# EasyEDA Pro project oscillation.eprj

# Schematic LM358V1
Create Date: 2023-12-05; Page Name: LM358V1; Project Name: oscillation; Schematic Name: LM358V1; Update Date: 2023-12-06; Company: 嘉立创EDA; Page Size: A4; Version: V1.0
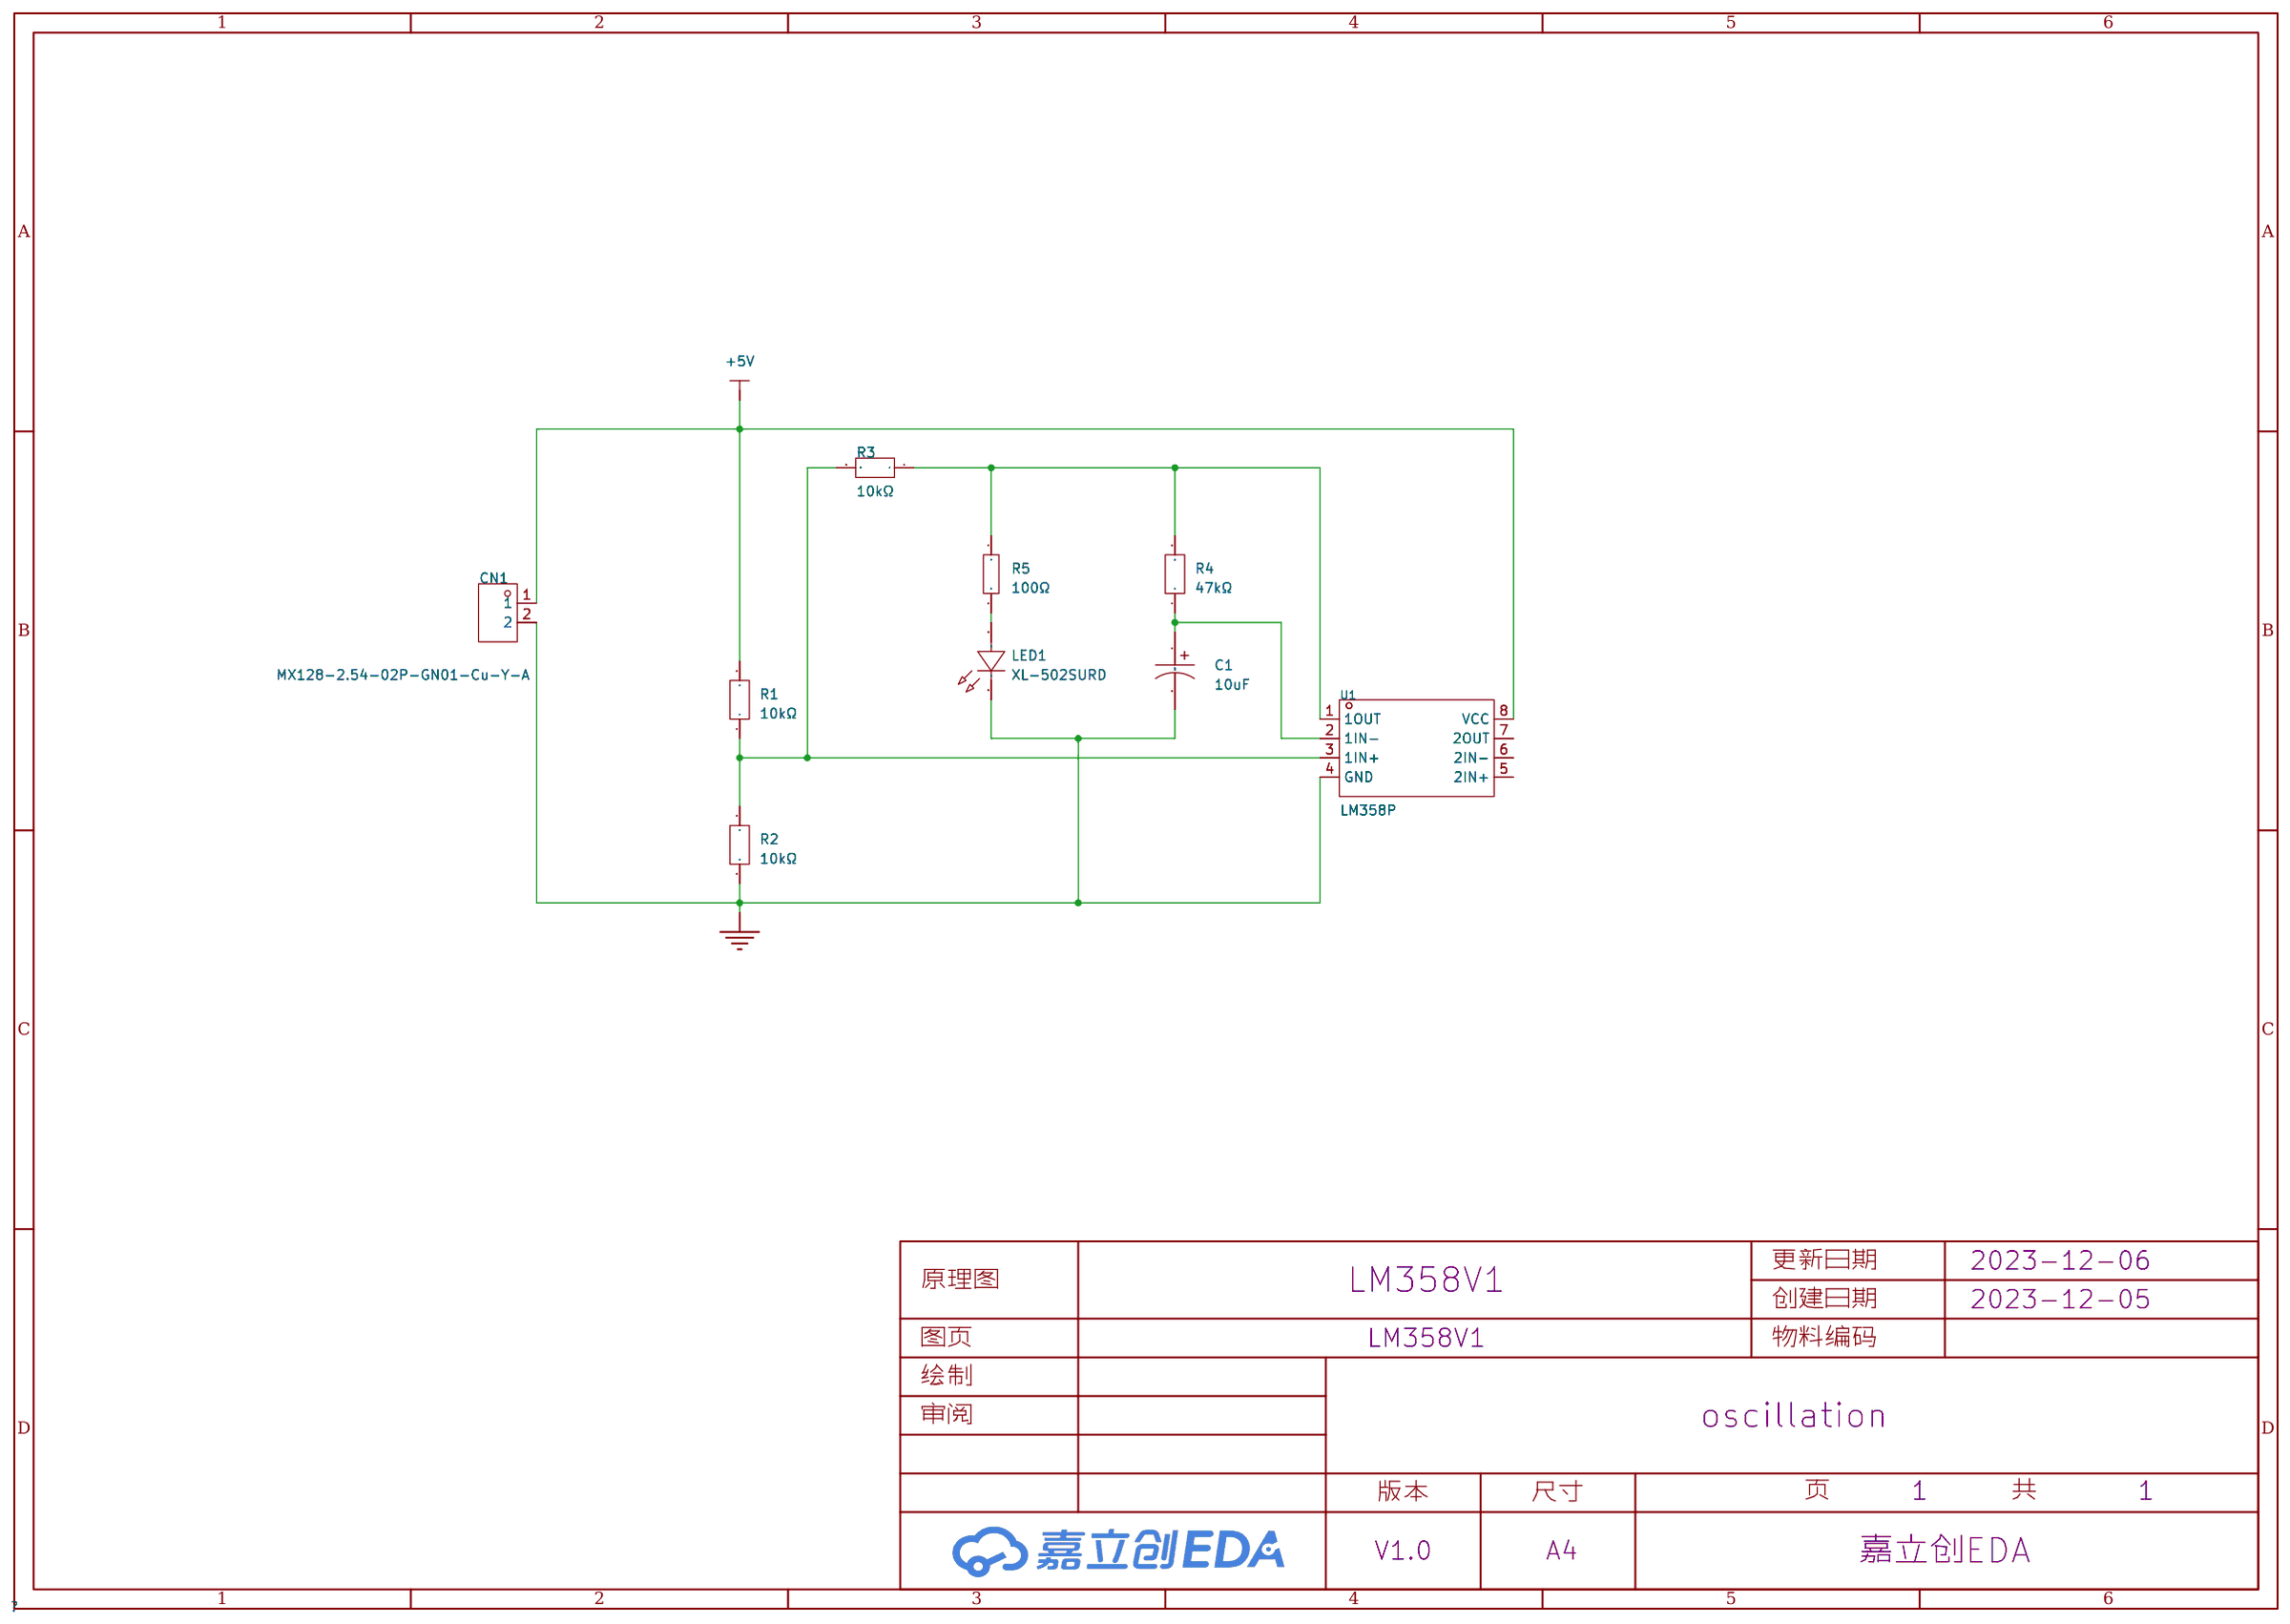
[diagram p0: schematic sheet]

## Parts
C1  10uF  [CAP-TH_BD5.0-P2.00-D0.8-FD]
CN1  MX128-2.54-02P-GN01-Cu-Y-A  [CONN-TH_2P-P2.54_MX128-2.54-GN01-02P-CU-Y-A]
LED1  XL-502SURD  [LED-TH_BD5.9-P2.54-RD_RED]
R1  10kΩ  [RES-TH_BD2.4-L6.3-P10.30-D0.6]
R2  10kΩ  [RES-TH_BD2.4-L6.3-P10.30-D0.6]
R3  10kΩ  [RES-TH_BD2.4-L6.3-P10.30-D0.6]
R4  47kΩ  [RES-TH_BD2.7-L6.2-P10.20-D0.4]
R5  100Ω  [RES-TH_BD2.2-L6.5-P10.50-D0.6]
U1  LM358P  [DIP-8_L9.4-W6.4-P2.54-LS9.1-BL]

## Library data of the parts
C1 = 01EC1809SHC10UF50V: 容值:10uF;精度:±20%;额定电压:50V;纹波电流:50mA@120Hz;等效串联电阻:-;; LCSC Part Name: 10uF ±20% 50V; Supplier Part: C503219; Manufacturer: KNSCHA(科尼盛); Supplier Footprint: 插件,D5xL11mm; JLCPCB Part Class: 扩展库; Datasheet: https://atta.szlcsc.com/upload/public/pdf/source/20200324/C503219_39D1683F20D4DB1C41D8BE9142629697.pdf; Supplier: LCSC; Tolerance: ±20%; Rated Voltage: 50V; Ripple Current: 50mA@120Hz; Lead Spacing: 2mm; φD: 5mm; L: 11mm; Lifetime @ Temp: 5000hrs@105℃
CN1 = MX128-2.54-02P-GN01-Cu-Y-A: 间距:2.54mm;结构:1x2P;安装方式:直插;排数:1;额定电流:6A;额定电压:150V;线规 - AWG:18~24;线规 - mm2:1;触头材质:铜合金;触头镀层:锡;工作温度范围:-40℃~+105℃;颜色:绿色;每排PIN数:2;; LCSC Part Name: 2.54mm 1x2P 排数:1 每排P数:2 直插; Supplier Part: C5188442; Manufacturer: MAX(迈旭); Supplier Footprint: 插件,P=2.54mm; JLCPCB Part Class: 扩展库; Datasheet: https://atta.szlcsc.com/upload/public/pdf/source/20230914/7C75AD31AD41EB9EF855A76DB002C0D2.pdf; Supplier: LCSC; Pitch: 2.54mm; Structure: 1x2P; Mounting Style: 直插; Number of Pins: 2P; Number of Rows: 1; Current Rating (Max): 6A; Voltage Rating (Max): 150V; Wire Gauge - AWG: 18~24; Wire Gauge - mm2: 1; Contact Material: 铜合金; Contact Plating: 锡; Operating Temperature Range: -40℃~+105℃; Color: 绿色; Number of PINs Per Row: 2
LED1 = XL-502SURD: 发光颜色:红灯;主波长:-;色温:-;功率:80mW;安装方式:-;; LCSC Part Name: 红灯; Supplier Part: C2895492; Manufacturer: XINGLIGHT(成兴光); Supplier Footprint: 插件,D=5mm; JLCPCB Part Class: 扩展库; Datasheet: https://atta.szlcsc.com/upload/public/pdf/source/20220816/7D3B6C5DAA6D3D612C28AF3454ED9DF8.pdf; Supplier: LCSC; Emitted Color: 红灯; Lens Color: 红色; Peak Wavelength: 625nm; Forward Current: 20mA; Power Dissipation: 80mW; Viewing Angle: 50°; Operating Temperature: -25℃~+85℃; Lamp Holder Type: 5mm圆形灯头
R1-R3 = RN1/4W10KFT/BA1: 阻值:10kΩ;精度:±1%;功率:250mW;温度系数:±50ppm/℃;电阻类型:金属膜电阻;; LCSC Part Name: 10kΩ ±1% 250mW 金属膜电阻; Supplier Part: C410695; Manufacturer: Tyohm(幸亚电阻); Supplier Footprint: 插件; JLCPCB Part Class: 扩展库; Datasheet: https://atta.szlcsc.com/upload/public/pdf/source/20190808/C410699_D126E64D28B638F1D73B58E9F61DFD9B.pdf; Supplier: LCSC; Tolerance: ±1%; Power(Watts): 250mW; Overload Voltage (Max): 250V; Temperature Coefficient: ±50ppm/℃; Type: 金属膜电阻; Operating Temperature Range: -55℃~+125℃
R4 = MF1/4W-47K±1%-ST52: 阻值:47kΩ;精度:±1%;功率:250mW;温度系数:±350ppm/℃;电阻类型:金属膜电阻;; LCSC Part Name: 金属膜电阻 47kΩ ±1% 250mW; Supplier Part: C2857423; Manufacturer: VO(翔胜); Supplier Footprint: 插件,2.7x6.2mm; JLCPCB Part Class: 扩展库; Supplier: LCSC; Tolerance: ±1%; Power(Watts): 250mW; Overload Voltage (Max): 250V; Temperature Coefficient: ±350ppm/℃; Type: 金属膜电阻; Operating Temperature Range: -55℃~+155℃
R5 = MFR0W4F1000A50: 阻值:100Ω;精度:±1%;功率:250mW;温度系数:±50ppm/℃;电阻类型:金属膜电阻;; LCSC Part Name: 100Ω ±1% 250mW 金属膜电阻; Supplier Part: C57438; Manufacturer: UNI-ROYAL(厚声); Supplier Footprint: 插件; JLCPCB Part Class: Extended Part; Datasheet: https://atta.szlcsc.com/upload/public/pdf/source/20191012/C436293_8820AA14BC71FA35E551C06C441482A0.pdf; Supplier: LCSC; Tolerance: ±1%; Power(Watts): 250mW; Overload Voltage (Max): 250V; Temperature Coefficient: ±50ppm/℃; Type: 金属膜电阻
U1 = LM358P: 放大器组数:2;带宽(-3db):-;输入偏置电流(Ib):20nA;增益带宽积(GBP):700kHz;压摆率(SR):0.3V/us;; Supplier Part: C5213; Manufacturer: TI(德州仪器); Supplier Footprint: DIP-8; JLCPCB Part Class: 扩展库; Datasheet: http://www.ti.com/cn/lit/gpn/lm358; Supplier: LCSC; Number of Circuits: 2; Current - Input Bias(Ib): 20nA; Gain Bandwidth Product(GBP): 700kHz; Slew Rate(SR): 0.3V/us; Output Current: 40mA; Supply Current: 1mA; Operating Temperature: 0℃~+70℃

## Nets
+5V: CN1.1 R1.2 U1.8(VCC)
GND: C1.2 CN1.2 LED1.1(K) R2.1 U1.4(GND)
$1N607: R1.1 R2.2 R3.2 U1.3(1IN+)
$1N832: LED1.2(A) R5.2
$1N1121: R3.1 R4.2 R5.1 U1.1(1OUT)
$1N1178: C1.1 R4.1 U1.2(1IN-)

Not connected (* = marked no-connect by the designer): U1 5(2IN+) 6(2IN-) 7(2OUT)

# Schematic IRM_ITR2001V1
Create Date: 2024-06-09; Page Name: P1; Project Name: oscillation; Schematic Name: ITR2001V1; Update Date: 2024-06-09; Company: 嘉立创EDA; Page Size: A4; Version: V1.0
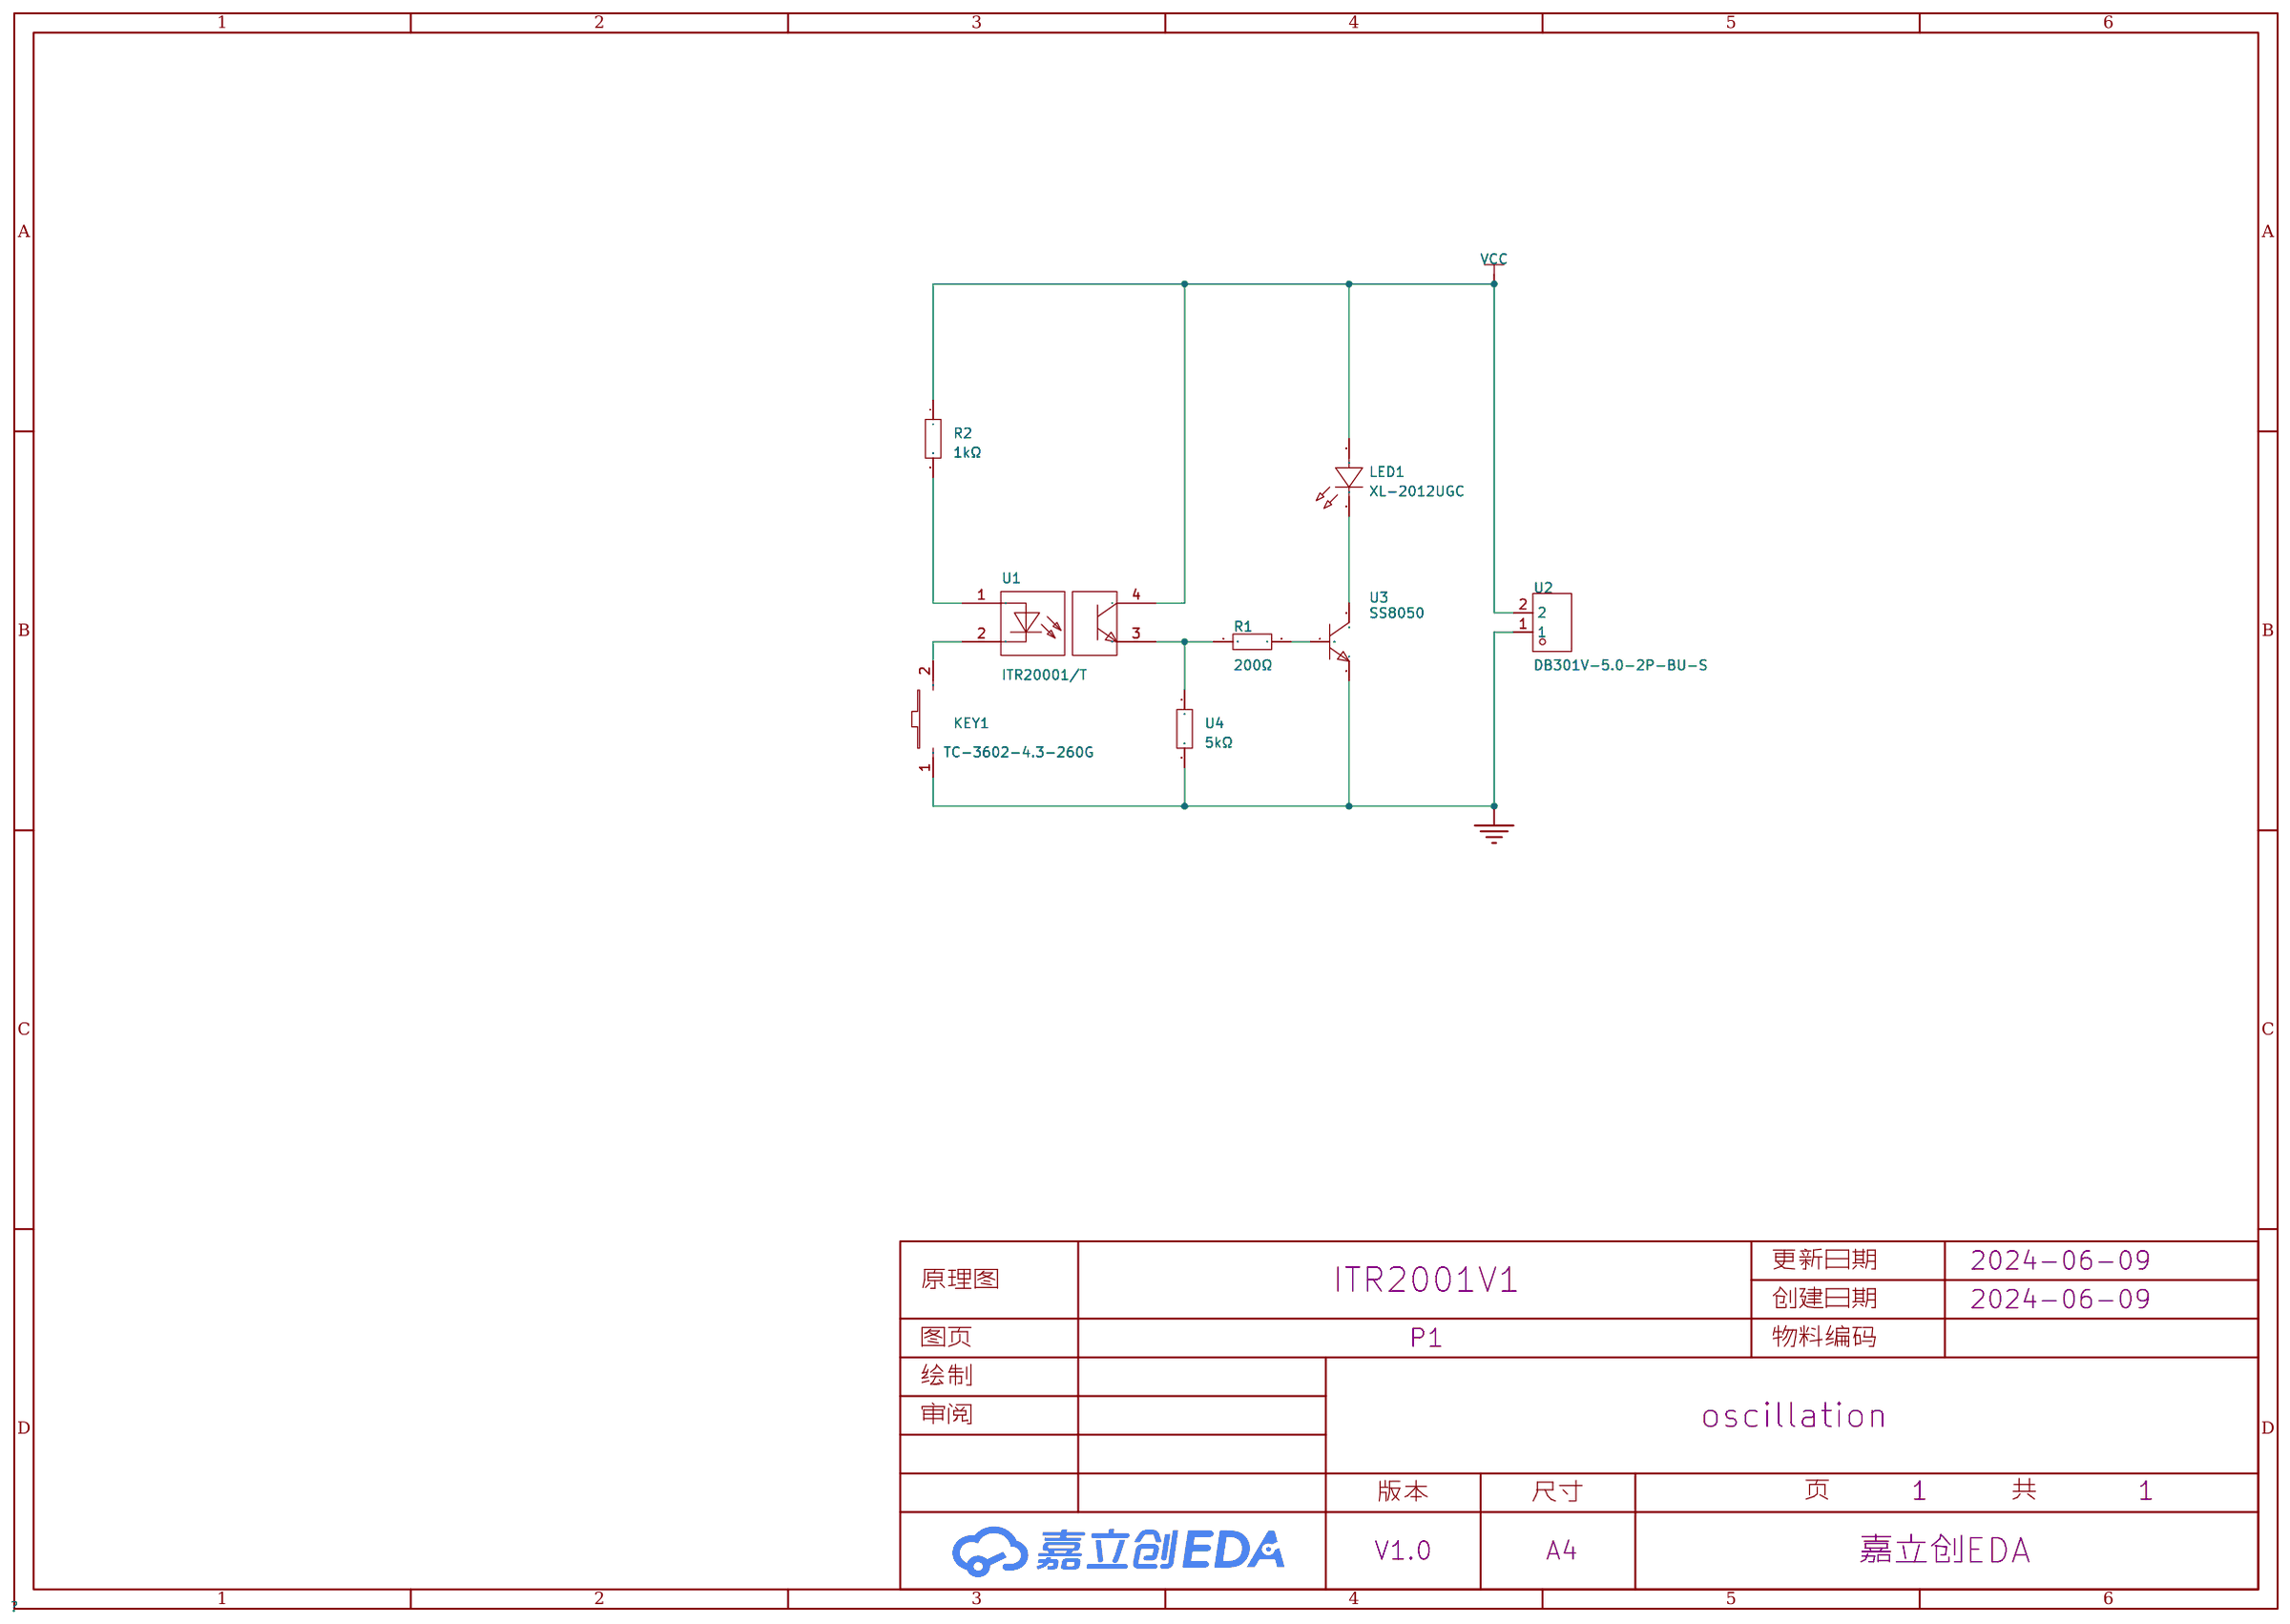
[diagram p1: schematic sheet]

## Parts
KEY1  TC-3602-4.3-260G  [KEY-SMD_L6.0-W3.6-LS8.3-L]
LED1  XL-2012UGC  [LED0805-RD_GREEN]
R1  200Ω  [R0603]
R2  1kΩ  [R0603]
U1  ITR20001/T  [OPTO-TH_4P_ITR20001-T-F316]
U2  DB301V-5.0-2P-BU-S  [CONN-TH_2P-P5.00_L7.6-W10.0]
U3  SS8050  [SOT-23-3_L2.9-W1.3-P1.90-LS2.4-BR]
U4  5kΩ  [R0603]

## Library data of the parts
KEY1 = TC-3602-4.3-260G_C3012022: 电路结构:单刀单掷;带支架:否;触点电流:50mA;额定电压(AC):-;额定电压(DC):12V;额定功率:-;安装方式:立贴;绝缘电阻:-;带灯:无;作用力:260gf;机械寿命:10万次;; LCSC Part Name: 3*6*4.3mm 立贴 轻触开关; Supplier Part: C3012022; Manufacturer: HCTL(华灿天禄); Supplier Footprint: SMD; JLCPCB Part Class: 扩展库; Datasheet: https://atta.szlcsc.com/upload/public/pdf/source/20210730/C2845293_5277CDF8C59032B794BE536E6FDEACDD.pdf; Supplier: LCSC; Circuit: 单刀单掷; Actuator Style: 圆形按钮; Switch Length: 3mm; Switch Width: 6mm; Switch Height: 4.3mm; Strike Gundam: 否; Contact Current: 50mA; Voltage Rating (DC): 12V; Mounting Style: 立贴; Actuator/Cap Color: 白色; With Lamp: 无; Operating Force: 260gf; Mechanical Life: 10万次; Operating Temperature: -30℃~+85℃
LED1 = XL-2012UGC: 发光颜色:翠绿色;功率:80mW;正向电流:25mA;主波长:516nm~525nm;透镜颜色:无色透明透镜;色温:-;发光角度:120°;载带方式:正贴;工作温度:-30℃~+85℃;; Supplier Part: C965815; Manufacturer: XINGLIGHT(成兴光); Supplier Footprint: 0805; JLCPCB Part Class: 扩展库; Datasheet: https://atta.szlcsc.com/upload/public/pdf/source/20221102/ACA6CBC413A1A8AF38BEBA54306464BE.pdf; Supplier: LCSC; Emitted Color: 翠绿色; Power Dissipation: 80mW; Forward Current: 25mA; Dominant Wavelength: 516nm~525nm; Peak Wavelength: 534nm; Lens Color: 无色透明透镜; Viewing Angle: 120°; Mounting Sytle: 正贴; Operating Temperature: -30℃~+85℃
R1 = 0603WAF2000T5E: 电阻类型:厚膜电阻;阻值:200Ω;精度:±1%;功率:100mW;最大工作电压:75V;温度系数:±100ppm/℃;; LCSC Part Name: 200Ω ±1% 100mW 厚膜电阻; Supplier Part: C8218; Manufacturer: UNI-ROYAL(厚声); Supplier Footprint: 0603; JLCPCB Part Class: 基础库; Datasheet: https://atta.szlcsc.com/upload/public/pdf/source/20200306/C422600_1E6D84923E4A46A82E41ADD87F860B5C.pdf; Supplier: LCSC; Type: 厚膜电阻; Tolerance: ±1%; Power(Watts): 100mW; Overload Voltage (Max): 75V; Temperature Coefficient: ±100ppm/℃; Operating Temperature Range: -55℃~+155℃
R2 = RC0603FR-071KL: 电阻类型:厚膜电阻;阻值:1kΩ;精度:±1%;功率:100mW;最大工作电压:75V;温度系数:±100ppm/℃;; LCSC Part Name: 厚膜电阻 1kΩ ±1% 100mW; Supplier Part: C22548; Manufacturer: YAGEO(国巨); Supplier Footprint: 0603; JLCPCB Part Class: 扩展库; Datasheet: https://atta.szlcsc.com/upload/public/pdf/source/20180316/70C0E2BDAE7FCC62C531A5A58D202EE1.pdf; Supplier: LCSC; Type: 厚膜电阻; Tolerance: ±1%; Power(Watts): 100mW; Overload Voltage (Max): 75V; Temperature Coefficient: ±100ppm/℃; Operating Temperature Range: -55℃~+155℃
U1 = ITR20001/T: 感应距离:5mm;集电极电流(最大值):20mA;; Supplier Part: C264269; Manufacturer: EVERLIGHT(亿光); Supplier Footprint: DIP-4; JLCPCB Part Class: 扩展库; Datasheet: https://atta.szlcsc.com/upload/public/pdf/source/20180817/C264269_4256B5400489B2A8B2B17FEF85C63C6F.pdf; Supplier: LCSC; Sensing Distance: 5mm; Collector Current (Max): 20mA
U2 = DB301V-5.0-2P-BU-S: 结构:1x2P;间距:5mm;颜色:蓝色;安装方式:直插;额定电流:17.5A;额定电压:250V;排数:1;线规 - AWG:14~22;线规 - 平方毫米:1.5;每排PIN数:2;工作温度范围:-40℃~+120℃;; LCSC Part Name: 5mm 1x2P 排数:1 每排P数:2 直插; Supplier Part: C395882; Manufacturer: DORABO(地博电气); Supplier Footprint: 插件,P=5mm; JLCPCB Part Class: 扩展库; Datasheet: https://atta.szlcsc.com/upload/public/pdf/source/20230321/D511151DA9A574FE7610C3CBEF6C1AC3.pdf; Supplier: LCSC; Structure: 1x2P; Pitch: 5mm; Color: 蓝色; Mounting Style: 直插; Current Rating (Max): 17.5A; Voltage Rating (Max): 250V; Number of Pins: 2P; Number of Rows: 1; Wire Gauge - AWG: 14~22; Wire Gauge - mm2: 1.5; Number of PINs Per Row: 2; Operating Temperature Range: -40℃~+120℃
U3 = SS8050_C7420370: 晶体管类型:NPN;集电极电流(Ic):1.5A;集射极击穿电压(Vceo):25V;功率(Pd):300mW;直流电流增益(hFE@Ic,Vce):120@100mA,1.0V;; LCSC Part Name: 耐压:25V 电流:1.5A NPN H档 200-350; Supplier Part: C7420370; Manufacturer: 宏迦橙; Supplier Footprint: SOT-23; JLCPCB Part Class: 扩展库; Datasheet: https://atta.szlcsc.com/upload/public/pdf/source/20231222/9C4050A7669EB24B3ACD0418218817FD.pdf; Supplier: LCSC; Transistor Type: NPN; Collector Current (Ic): 1.5A; Collector-Emitter Breakdown Voltage (Vceo): 25V; Power Dissipation (Pd): 300mW; DC Current Gain (hFE@Ic,Vce): 120@100mA,1.0V; Transition Frequency (fT): 100MHz; Collector Cut-Off Current (Icbo): 100nA; Collector-Emitter Saturation Voltage (VCE(sat)@Ic,Ib): 500mV@800mA,80mA; Operating Temperature: -55℃~+150℃
U4 = RT0603BRE075KL: 电阻类型:薄膜电阻;阻值:5kΩ;精度:±0.1%;功率:100mW;温度系数:±50ppm/℃;; LCSC Part Name: 薄膜电阻 5kΩ ±0.1% 100mW; Supplier Part: C862232; Manufacturer: YAGEO(国巨); Supplier Footprint: 0603; JLCPCB Part Class: 扩展库; Datasheet: https://atta.szlcsc.com/upload/public/pdf/source/20200610/C326738_5639A9F1B6EB6E4AE2197577D3456E7F.pdf; Supplier: LCSC; Type: 薄膜电阻; Tolerance: ±0.1%; Power(Watts): 100mW; Temperature Coefficient: ±50ppm/℃; Operating Temperature Range: -55℃~+155℃

## Nets
GND: KEY1.1 U2.1 U3.2(E) U4.2
VCC: LED1.2(A) R2.1 U1.4 U2.2
$1N421: KEY1.2 U1.2
$1N496: LED1.1(K) U3.3(C)
$1N669: R1.1 U1.3 U4.1
$1N670: R1.2 U3.1(B)
$1N788: R2.2 U1.1

# Schematic IRM_940NMV1
Create Date: 2024-06-10; Page Name: P1; Project Name: oscillation; Schematic Name: IRM_940NMV1; Update Date: 2024-06-10; Company: 嘉立创EDA; Page Size: A4; Version: V1.0
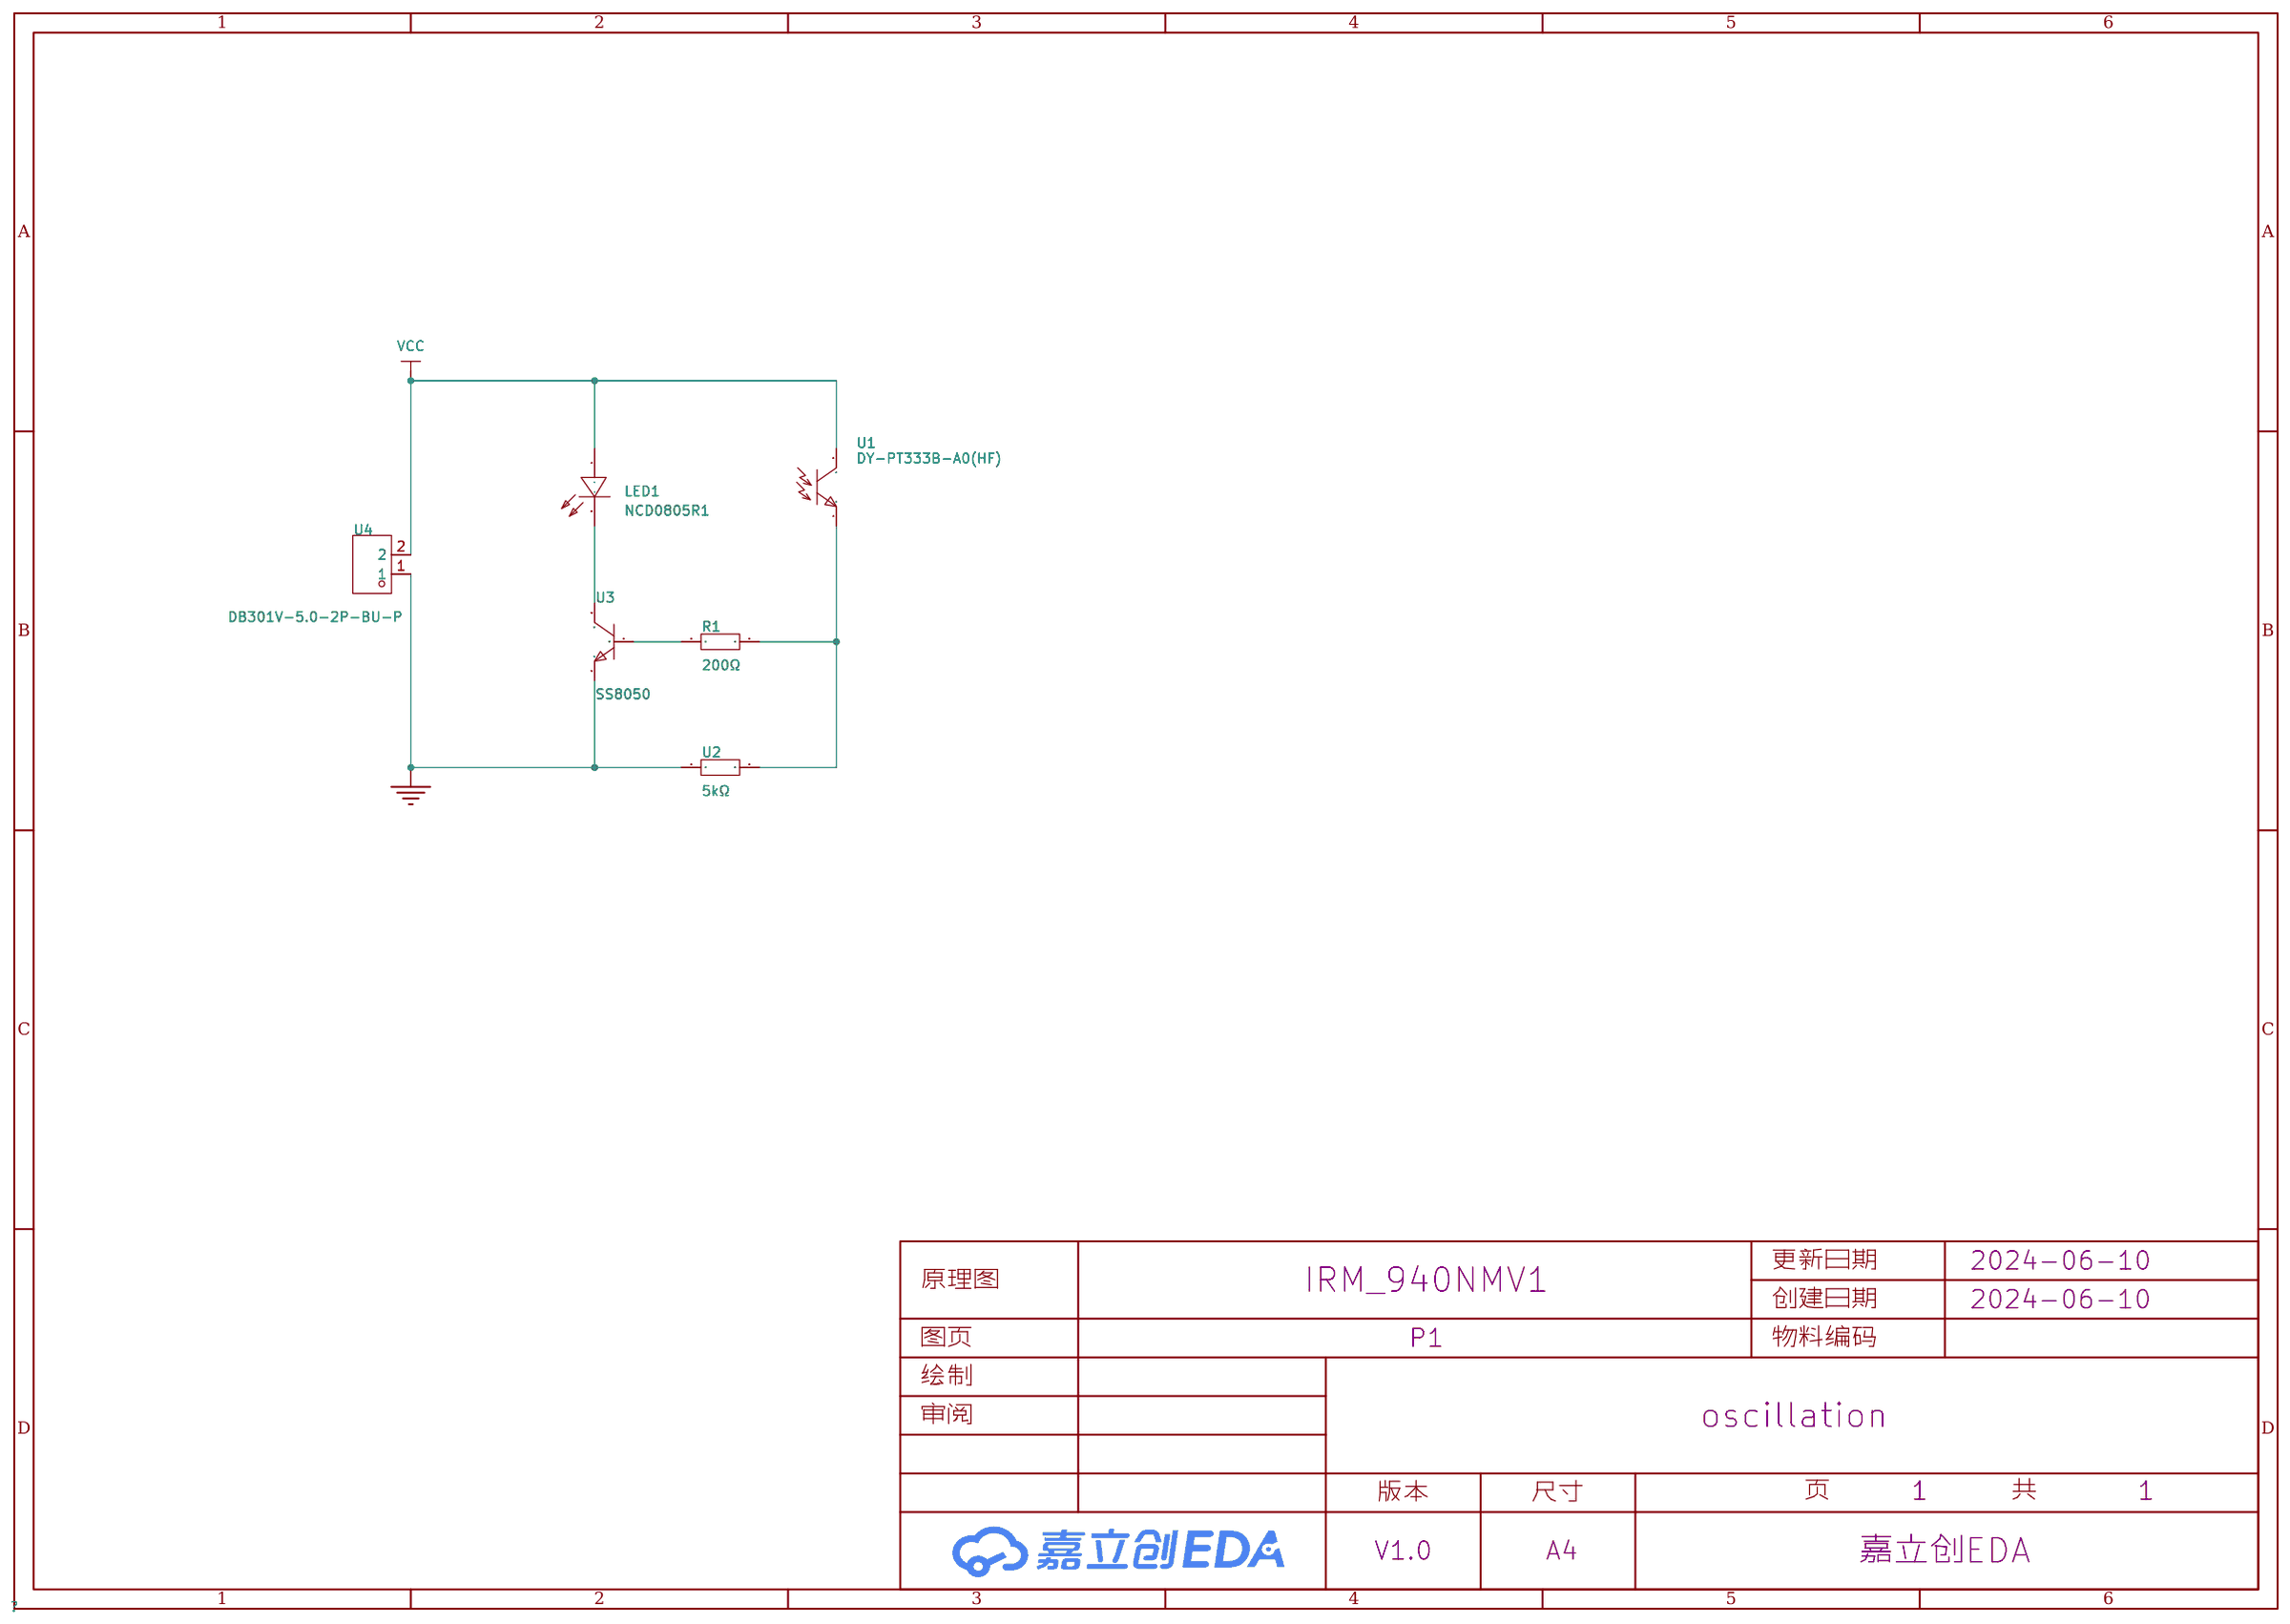
[diagram p2: schematic sheet]

## Parts
LED1  NCD0805R1  [LED0805-R-RD]
R1  200Ω  [R0603]
U1  DY-PT333B-A0(HF)  [LED-TH_BD5.9-RD_DY-PT334-6B]
U2  5kΩ  [R0603]
U3  SS8050  [SOT-23-3_L2.9-W1.3-P1.90-LS2.4-BR]
U4  DB301V-5.0-2P-BU-P  [CONN-TH_2P-P5.00_DB301V-5.0-2P-BU-P]

## Library data of the parts
LED1 = NCD0805R1: 灯头类型:-;发光颜色:红色;正向电压(VF):1.6V~2.6V;功率:65mW;正向电流:20mA;主波长:615nm~630nm;二极管配置:独立二极管;透镜颜色:无色透明透镜;色温:-;发光强度:67mcd~195mcd;发光角度:130°;载带方式:-;工作温度:-30℃~+85℃;; Supplier Part: C84256; Manufacturer: 国星光电; Supplier Footprint: 0805; JLCPCB Part Class: 基础库; Datasheet: https://atta.szlcsc.com/upload/public/pdf/source/20200820/C84256_F0A75A43B3EAD75808600A0514C76B99.pdf; Supplier: LCSC; Emitted Color: 红色; Forward Voltage (VF): 1.6V~2.6V; Power Dissipation: 65mW; Forward Current: 20mA; Dominant Wavelength: 615nm~630nm; Diode Configuration: 独立二极管; Lens Color: 无色透明透镜; Luminous Intensity: 67mcd~195mcd; Viewing Angle: 130°; Operating Temperature: -30℃~+85℃
R1 = 0603WAF2000T5E: 电阻类型:厚膜电阻;阻值:200Ω;精度:±1%;功率:100mW;最大工作电压:75V;温度系数:±100ppm/℃;; LCSC Part Name: 200Ω ±1% 100mW 厚膜电阻; Supplier Part: C8218; Manufacturer: UNI-ROYAL(厚声); Supplier Footprint: 0603; JLCPCB Part Class: 基础库; Datasheet: https://atta.szlcsc.com/upload/public/pdf/source/20200306/C422600_1E6D84923E4A46A82E41ADD87F860B5C.pdf; Supplier: LCSC; Type: 厚膜电阻; Tolerance: ±1%; Power(Watts): 100mW; Overload Voltage (Max): 75V; Temperature Coefficient: ±100ppm/℃; Operating Temperature Range: -55℃~+155℃
U1 = DY-PT333B-A0(HF): 宽上/下升时间：15uS@@峰值波长：940nm@@光谱带宽：800-1100mcd; LCSC Part Name: 红外接收三极管5mm圆头有边; Supplier Part: C7470721; Manufacturer: TONYU(东裕); Supplier Footprint: D=5mm; JLCPCB Part Class: 扩展库; Datasheet: https://atta.szlcsc.com/upload/public/pdf/source/20230726/C7DC9E065AA9087FC6EA5CAE15735987.pdf; Supplier: LCSC
U2 = RT0603BRE075KL: 电阻类型:薄膜电阻;阻值:5kΩ;精度:±0.1%;功率:100mW;温度系数:±50ppm/℃;; LCSC Part Name: 薄膜电阻 5kΩ ±0.1% 100mW; Supplier Part: C862232; Manufacturer: YAGEO(国巨); Supplier Footprint: 0603; JLCPCB Part Class: 扩展库; Datasheet: https://atta.szlcsc.com/upload/public/pdf/source/20200610/C326738_5639A9F1B6EB6E4AE2197577D3456E7F.pdf; Supplier: LCSC; Type: 薄膜电阻; Tolerance: ±0.1%; Power(Watts): 100mW; Temperature Coefficient: ±50ppm/℃; Operating Temperature Range: -55℃~+155℃
U3 = SS8050_C7420370: 晶体管类型:NPN;集电极电流(Ic):1.5A;集射极击穿电压(Vceo):25V;功率(Pd):300mW;直流电流增益(hFE@Ic,Vce):120@100mA,1.0V;; LCSC Part Name: 耐压:25V 电流:1.5A NPN H档 200-350; Supplier Part: C7420370; Manufacturer: 宏迦橙; Supplier Footprint: SOT-23; JLCPCB Part Class: 扩展库; Datasheet: https://atta.szlcsc.com/upload/public/pdf/source/20231222/9C4050A7669EB24B3ACD0418218817FD.pdf; Supplier: LCSC; Transistor Type: NPN; Collector Current (Ic): 1.5A; Collector-Emitter Breakdown Voltage (Vceo): 25V; Power Dissipation (Pd): 300mW; DC Current Gain (hFE@Ic,Vce): 120@100mA,1.0V; Transition Frequency (fT): 100MHz; Collector Cut-Off Current (Icbo): 100nA; Collector-Emitter Saturation Voltage (VCE(sat)@Ic,Ib): 500mV@800mA,80mA; Operating Temperature: -55℃~+150℃
U4 = DB301V-5.0-2P-BU-P: 结构:1x2P;间距:5mm;颜色:蓝色;安装方式:直插;额定电流:17.5A;额定电压:250V;排数:1;线规 - AWG:14~22;线规 - 平方毫米:0.75~1.5;每排PIN数:2;触头材质:-;触头镀层:-;工作温度范围:-30℃~+105℃;焊接温度(最大值):-;; LCSC Part Name: 5mm 1x2P 排数:1 每排P数:2 直插; Supplier Part: C430621; Manufacturer: DORABO(地博电气); Supplier Footprint: 插件,P=5mm; JLCPCB Part Class: 扩展库; Datasheet: https://atta.szlcsc.com/upload/public/pdf/source/20230321/D511151DA9A574FE7610C3CBEF6C1AC3.pdf; Supplier: LCSC; Structure: 1x2P; Pitch: 5mm; Color: 蓝色; Mounting Style: 直插; Current Rating (Max): 17.5A; Voltage Rating (Max): 250V; Number of Pins: 2P; Number of Rows: 1; Wire Gauge - AWG: 14~22; Wire Gauge - mm2: 0.75~1.5; Number of PINs Per Row: 2; Operating Temperature Range: -30℃~+105℃

## Nets
GND: U2.1 U3.2(E) U4.1
VCC: LED1.1(+) U1.2(C) U4.2
$1N413: R1.1 U3.1(B)
$1N527: LED1.2(-) U3.3(C)
$1N534: R1.2 U1.1(E) U2.2

# Schematic Schematic1
Create Date: 2024-06-30; Page Name: P1; Project Name: oscillation; Schematic Name: Schematic1; Update Date: 2024-06-30; Company: 嘉立创EDA; Page Size: A4; Version: V1.0
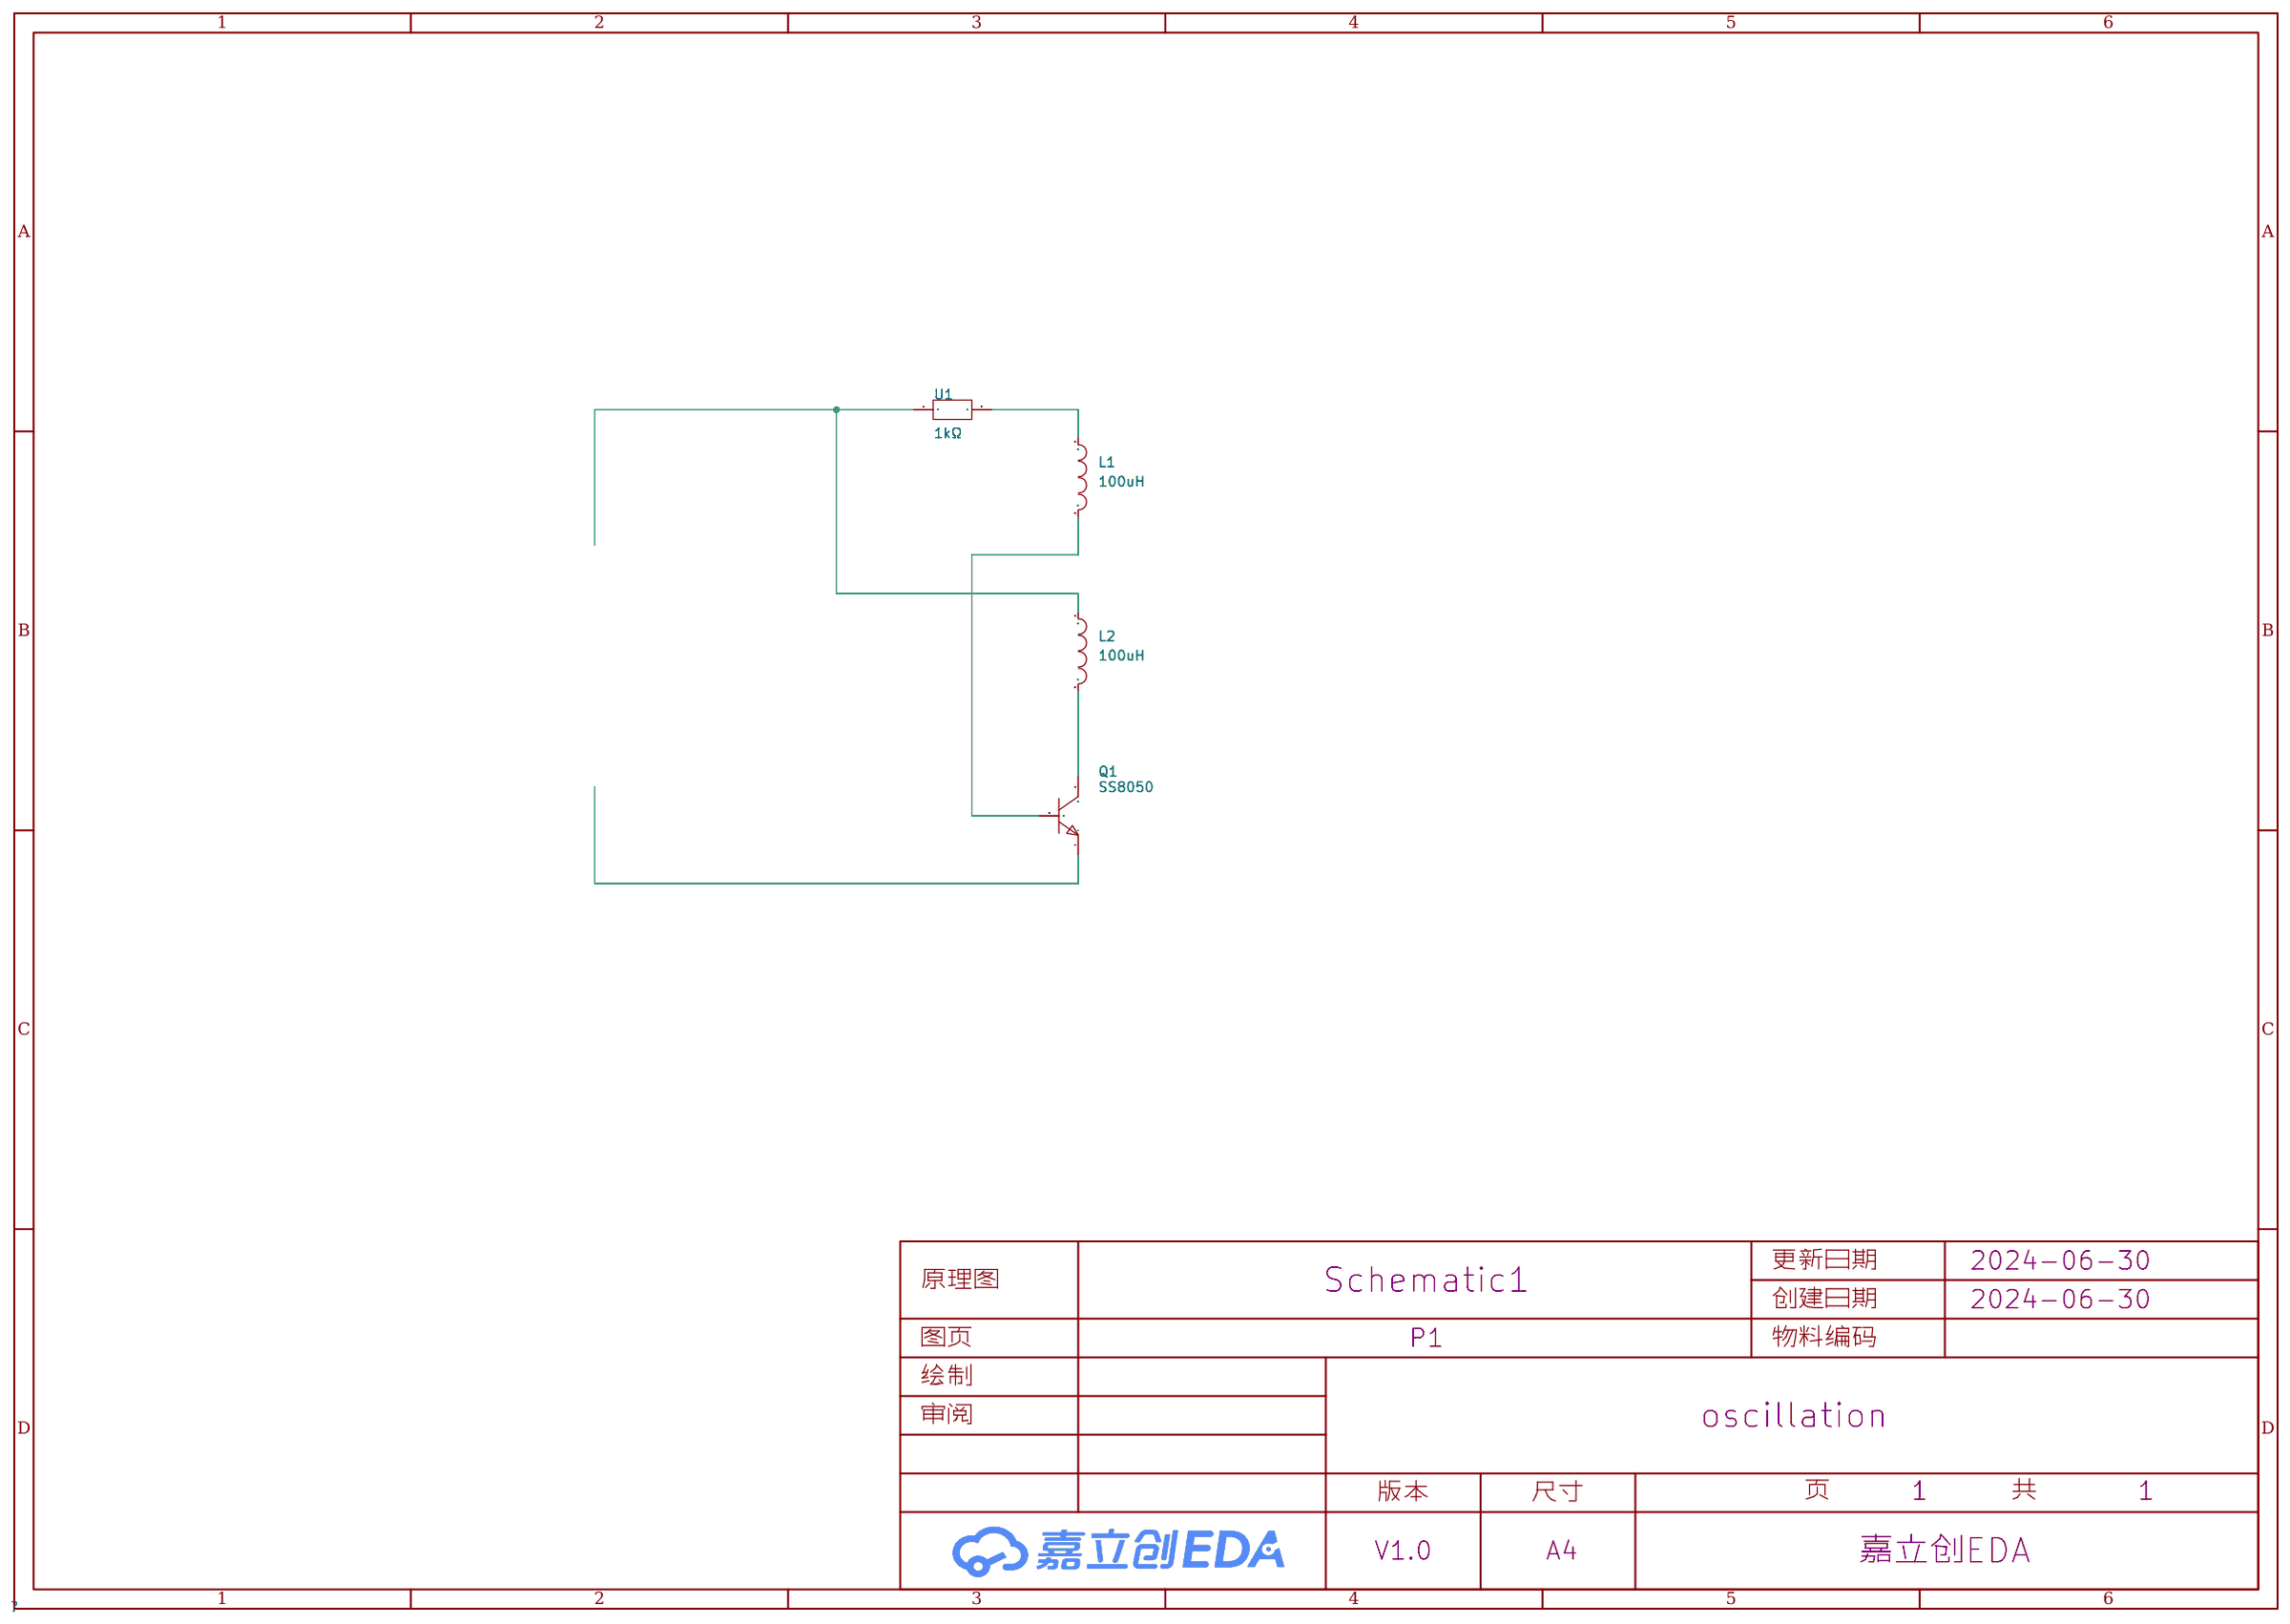
[diagram p3: schematic sheet]

## Parts
L1  100uH  [IND-TH_BD9.0-P5.00-D0.7]
L2  100uH  [IND-TH_BD9.0-P5.00-D0.7]
Q1  SS8050  [TO-92-3_L5.1-W4.1-P1.27-L]
U1  1kΩ  [RES-TH_BD1.9-L3.5-P7.50-D0.5]

## Library data of the parts
L1 L2 = PK0810-101MB: 电感值:100uH;精度:±20%;额定电流:900mA;类型:工字电感;; LCSC Part Name: 100uH ±20%; Supplier Part: C400315; Manufacturer: SXN(顺翔诺); Supplier Footprint: 插件; JLCPCB Part Class: 扩展库; Datasheet: https://atta.szlcsc.com/upload/public/pdf/source/20210810/BA6D1DA7D4BCBB7C641BC97B42CFC6FF.pdf; Supplier: LCSC; Tolerance: ±20%; Rated Current: 900mA; DC Resistance (DCR): 200mΩ; Type: 工字电感
Q1 = SS8050_C150546: 晶体管类型:NPN;集电极电流(Ic):1.5A;集射极击穿电压(Vceo):25V;功率(Pd):625mW;直流电流增益(hFE@Ic,Vce):160@100mA,1V;; LCSC Part Name: SS8050(RANGE:160-300) D档 160-300; Supplier Part: C150546; Manufacturer: CJ(江苏长电/长晶); Supplier Footprint: TO-92-3; JLCPCB Part Class: 扩展库; Datasheet: https://atta.szlcsc.com/upload/public/pdf/source/20180122/C150546_15166125460571291137.pdf; Supplier: LCSC; Transistor Type: NPN; Collector Current (Ic): 1.5A; Collector-Emitter Breakdown Voltage (Vceo): 25V; Power Dissipation (Pd): 625mW; DC Current Gain (hFE@Ic,Vce): 160@100mA,1V; Transition Frequency (fT): 100MHz; Collector Cut-Off Current (Icbo): 100nA; Collector-Emitter Saturation Voltage (VCE(sat)@Ic,Ib): 500mV@800mA,80mA
U1 = LR0204F1K0: 阻值:1kΩ;精度:±1%;功率:250mW;温度系数:±100ppm/℃;; LCSC Part Name: 1kΩ ±1% 250mW; Supplier Part: C1374287; Manufacturer: TE Connectivity(泰科电子); Supplier Footprint: 插件; JLCPCB Part Class: 扩展库; Datasheet: https://atta.szlcsc.com/upload/public/pdf/source/20181106/C306225_86C02C11EE35865DCD1FF9FBE745AC62.pdf; Supplier: LCSC; Tolerance: ±1%; Power(Watts): 250mW; Temperature Coefficient: ±100ppm/℃; Operating Temperature Range: -55℃~155℃

## Nets
Net-(L1-1): L1.1 U1.2
Net-(L1-2): L1.2 Q1.2(B)
Net-(L2-1): L2.1 U1.1
Net-(L2-2): L2.2 Q1.3(C)

Not connected (* = marked no-connect by the designer): Q1 1(E)

# Board LM358V1
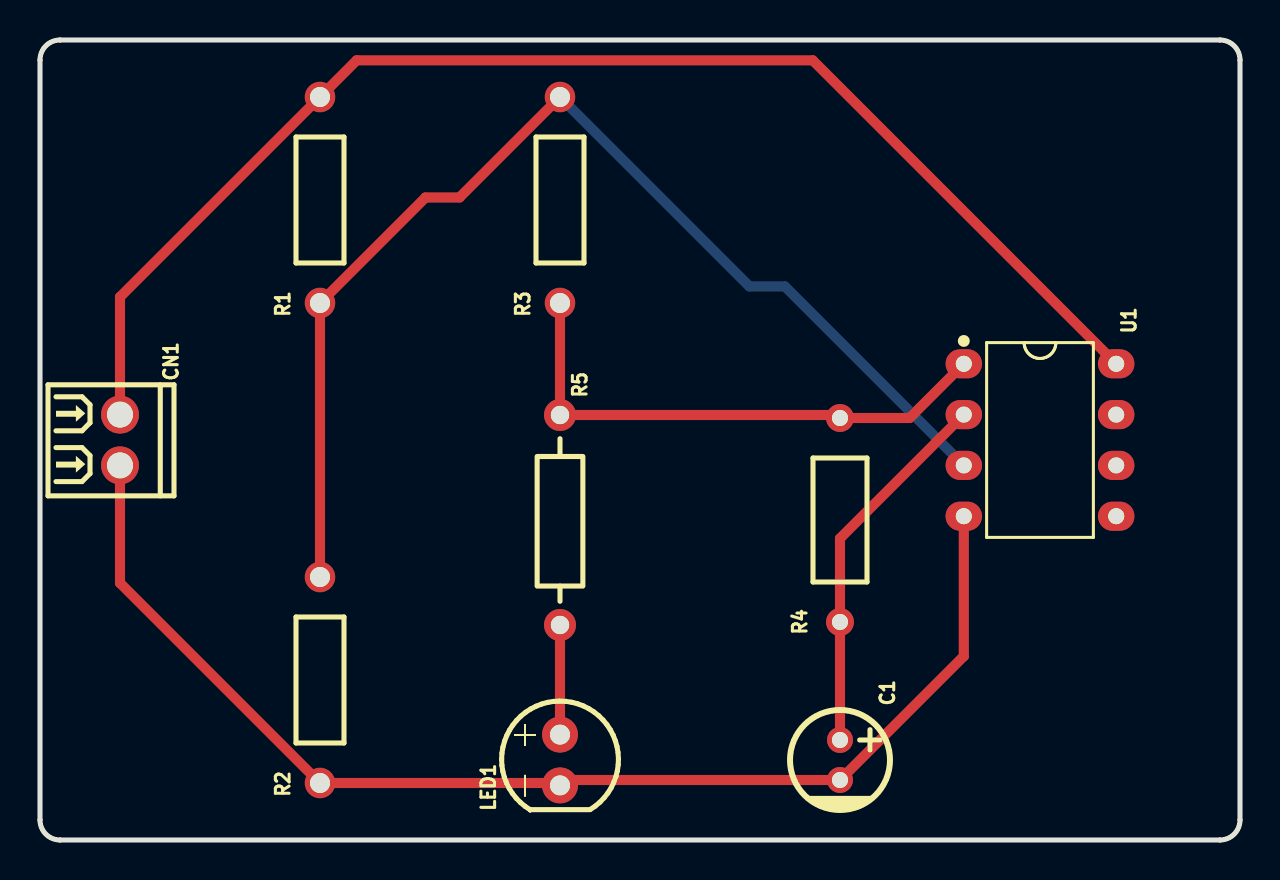
[diagram p4: board, top side]
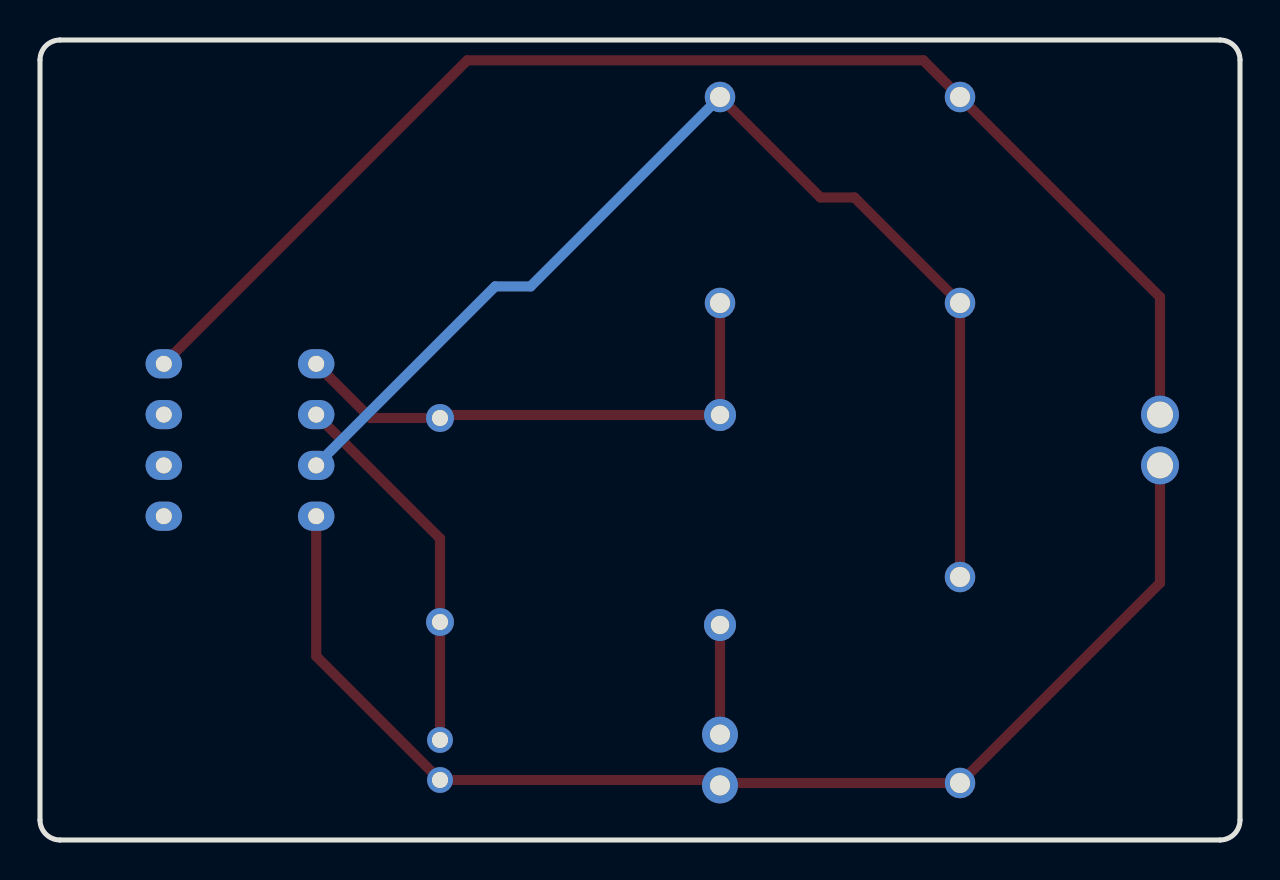
[diagram p5: board, bottom side, seen from below]

Outline 60 x 40 mm; copper layers: Top Layer, Bottom Layer. Coordinates in mm from the lower left corner of the outline.
Outline path: 0,39 0,1 arc(0.29,0.29) 1,0 59,0 arc(59.71,0.29) 60,1 60,39 arc(59.71,39.71) 59,40 1,40 arc(0.29,39.71) 0,39
Stack: Top Layer 0.035mm / Dielectric1 1.51mm FR4 er 4.5 / Bottom Layer 0.035mm

## Design rules (mm)
template: JLCPCB Capability(Two Layers Board)
spacing copperThickness1oz (default): track to track 0.102, other pairs 0.152 to 0.3
spacing copperThickness2oz: track to track 0.203, other pairs 0.152 to 0.3
track width copperThickness1oz (default): min 0.127, default 0.254, max 2.54
track width copperThickness2oz: min 0.203, default 0.254, max 2.54
differential pair differentialPair (default): width min 0.127, default 0.254, max 2.54; gap min 0.152, default 0.152
via viaSize (default): diameter min 0.5, default 0.61, max 10; hole min 0.3, default 0.305, max 6.3

## Placement (name value [footprint] x y rotation side)
C1  10uF  [CAP-TH_BD5.0-P2.00-D0.8-FD]  40 4 270 top
CN1  MX128-2.54-02P-GN01-Cu-Y-A  [CONN-TH_2P-P2.54_MX128-2.54-GN01-02P-CU-Y-A]  4 20 270 top
LED1  XL-502SURD  [LED-TH_BD5.9-P2.54-RD_RED]  26 4 90 top
R1  10kΩ  [RES-TH_BD2.4-L6.3-P10.30-D0.6]  14 32 90 top
R2  10kΩ  [RES-TH_BD2.4-L6.3-P10.30-D0.6]  14 8 90 top
R3  10kΩ  [RES-TH_BD2.4-L6.3-P10.30-D0.6]  26 32 90 top
R4  47kΩ  [RES-TH_BD2.7-L6.2-P10.20-D0.4]  40 16 90 top
R5  100Ω  [RES-TH_BD2.2-L6.5-P10.50-D0.6]  26 16 270 top
U1  LM358P  [DIP-8_L9.4-W6.4-P2.54-LS9.1-BL]  50 20 270 top

## Footprints (pads in the part's own frame, mm; a bottom-side part is the same pattern mirrored in y, then rotated)
CAP-TH_BD5.0-P2.00-D0.8-FD
  round 1.3 hole 0.8: 1(-1,0) 2(1,0)
CONN-TH_2P-P2.54_MX128-2.54-GN01-02P-CU-Y-A
  round 1.9 hole 1.3: 1(-1.27,0) 2(1.27,0)
DIP-8_L9.4-W6.4-P2.54-LS9.1-BL
  oval 1.46x1.825 hole 0.8: 1(-3.81,-3.81) 2(-1.27,-3.81) 3(1.27,-3.81) 4(3.81,-3.81) 5(3.81,3.81) 6(1.27,3.81) 7(-1.27,3.81) 8(-3.81,3.81)
LED-TH_BD5.9-P2.54-RD_RED
  round 1.8 hole 1: 1(-1.27,0) 2(1.27,0)
RES-TH_BD2.2-L6.5-P10.50-D0.6
  round 1.6 hole 0.914: 1(-5.25,0) 2(5.25,0)
RES-TH_BD2.4-L6.3-P10.30-D0.6
  round 1.524 hole 1: 1(-5.15,0) 2(5.15,0)
RES-TH_BD2.7-L6.2-P10.20-D0.4
  round 1.4 hole 0.8: 1(-5.1,0) 2(5.1,0)

## Nets
As in the schematic.

Pads without a net: U1 5 6 7

## Routing (per net, layer and track width the routed paths; a pad name or vN(x,y) marks a point on that pad's centre or on a via; arc(x,y) is an arc through that point)
+5V: length 66.9
  Top Layer w0.508: U1.8 38.64,38.98 15.83,38.98 R1.2 4,27.15 CN1.1
GND: length 61.9
  Top Layer w0.508: U1.4 46.19,9.19 C1.2 26.27,3 LED1.1 25.88,2.85 R2.1 4,12.85 CN1.2
$1N607: length 57.8
  Top Layer w0.508: R2.2 R1.1 19.28,32.13 20.98,32.13 R3.2
  Bottom Layer w0.508: U1.3 37.24,27.68 35.47,27.68 R3.2
$1N832: length 5.5
  Top Layer w0.508: R5.2 LED1.2
$1N1121: length 27
  Top Layer w0.508: R3.1 R5.1 39.85,21.25 R4.2 43.48,21.1 U1.1
$1N1178: length 18.8
  Top Layer w0.508: U1.2 40,15.08 R4.1 C1.1

# Board IRM_ITR2001V1
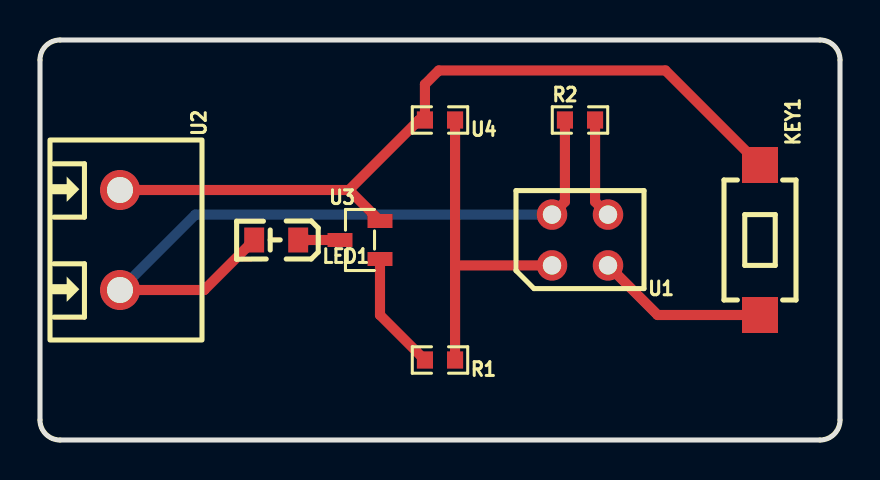
[diagram p6: board, top side]
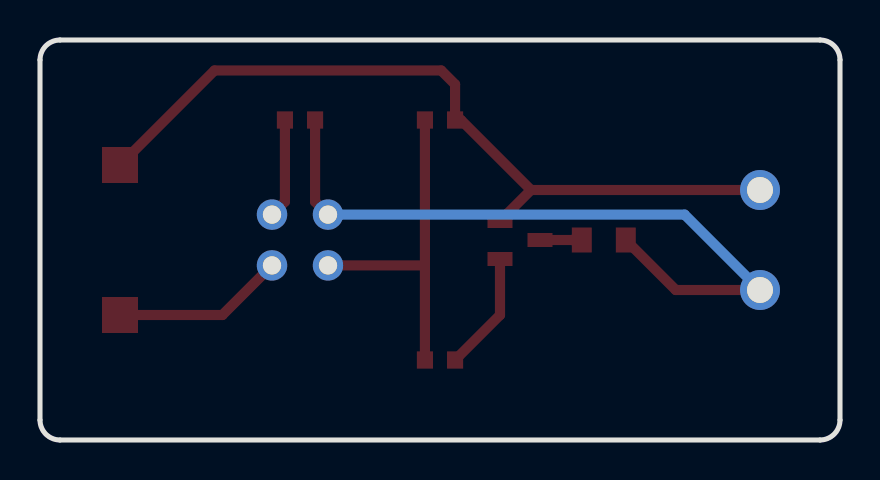
[diagram p7: board, bottom side, seen from below]

Outline 40 x 20 mm; copper layers: Top Layer, Bottom Layer. Coordinates in mm from the lower left corner of the outline.
Outline path: 0,19 0,1 arc(0.29,0.29) 1,0 39,0 arc(39.71,0.29) 40,1 40,19 arc(39.71,19.71) 39,20 1,20 arc(0.29,19.71) 0,19
Stack: Top Layer 0.035mm / Dielectric1 1.51mm FR4 er 4.5 / Bottom Layer 0.035mm

## Design rules (mm)
template: JLCPCB Capability(Two Layers Board)
spacing copperThickness1oz (default): track to track 0.102, other pairs 0.152 to 0.3
spacing copperThickness2oz: track to track 0.203, other pairs 0.152 to 0.3
track width copperThickness1oz (default): min 0.127, default 0.254, max 2.54
track width copperThickness2oz: min 0.203, default 0.254, max 2.54
differential pair differentialPair (default): width min 0.127, default 0.254, max 2.54; gap min 0.152, default 0.152
via viaSize (default): diameter min 0.5, default 0.61, max 10; hole min 0.3, default 0.305, max 6.3

## Placement (name value [footprint] x y rotation side)
KEY1  TC-3602-4.3-260G  [KEY-SMD_L6.0-W3.6-LS8.3-L]  36 10 270 top
LED1  XL-2012UGC  [LED0805-RD_GREEN]  11.81 10 180 top
R1  200Ω  [R0603]  20 4 180 top
R2  1kΩ  [R0603]  27 16 0 top
U1  ITR20001/T  [OPTO-TH_4P_ITR20001-T-F316]  27 10 180 top
U2  DB301V-5.0-2P-BU-S  [CONN-TH_2P-P5.00_L7.6-W10.0]  4 10 270 top
U3  SS8050  [SOT-23-3_L2.9-W1.3-P1.90-LS2.4-BR]  16 10 0 top
U4  5kΩ  [R0603]  20 16 180 top

## Footprints (pads in the part's own frame, mm; a bottom-side part is the same pattern mirrored in y, then rotated)
CONN-TH_2P-P5.00_L7.6-W10.0
  round 2 hole 1.3: 1(-2.5,0) 2(2.5,0)
KEY-SMD_L6.0-W3.6-LS8.3-L
  rect 1.8x1.8 smd: 1(-3.75,0) 2(3.75,0)
LED0805-RD_GREEN
  rect 1x1.25 smd: 1(-1.1,0) 2(1.1,0)
OPTO-TH_4P_ITR20001-T-F316
  round 1.524 hole 0.914: 1(-1.4,-1.27) 2(-1.4,1.27) 3(1.4,1.27) 4(1.4,-1.27)
R0603
  rect 0.806x0.864 smd: 1(-0.753,0) 2(0.753,0)
SOT-23-3_L2.9-W1.3-P1.90-LS2.4-BR
  rect 1.25x0.7 smd: 1(1,-0.95) 2(1,0.95) 3(-1,0)

## Nets
As in the schematic.

## Routing (per net, layer and track width the routed paths; a pad name or vN(x,y) marks a point on that pad's centre or on a via; arc(x,y) is an arc through that point)
GND: length 39.7
  Top Layer w0.508: 15.45,12.5 18.95,16 U4.2 19.25,17.78 19.94,18.48 31.27,18.48 KEY1.1 ; 15.45,12.5 U2.1 ; 15.45,12.5 U3.2
VCC: length 35.9
  Top Layer w0.508: LED1.2 8.21,7.5 U2.2 ; U1.4 26.25,11.92 R2.1
  Bottom Layer w0.508: U2.2 7.77,11.27 U1.4
$1N421: length 8.6
  Top Layer w0.508: U1.2 30.88,6.25 KEY1.2
$1N496: length 2.1
  Top Layer w0.508: LED1.1 U3.3
$1N669: length 16.9
  Top Layer w0.508: 20.75,8.69 R1.1 ; 20.75,8.69 20.79,8.73 U1.3 ; 20.75,8.69 U4.1
$1N670: length 6
  Top Layer w0.508: R1.2 17,6.25 U3.1
$1N788: length 5
  Top Layer w0.508: U1.1 27.75,11.92 R2.2

# Board IRM_940NMV1
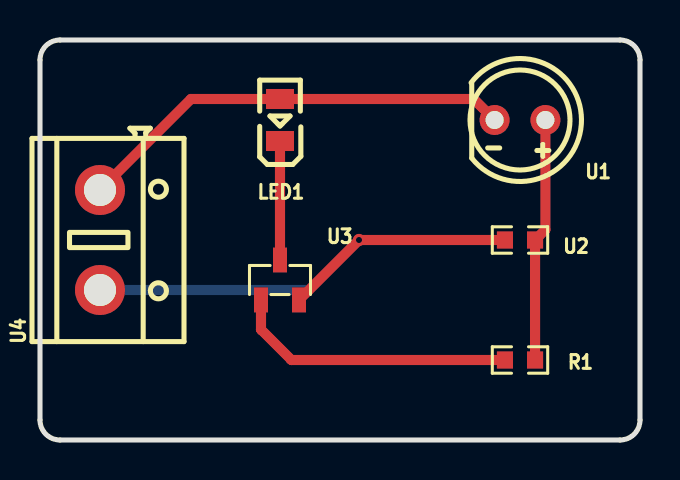
[diagram p8: board, top side]
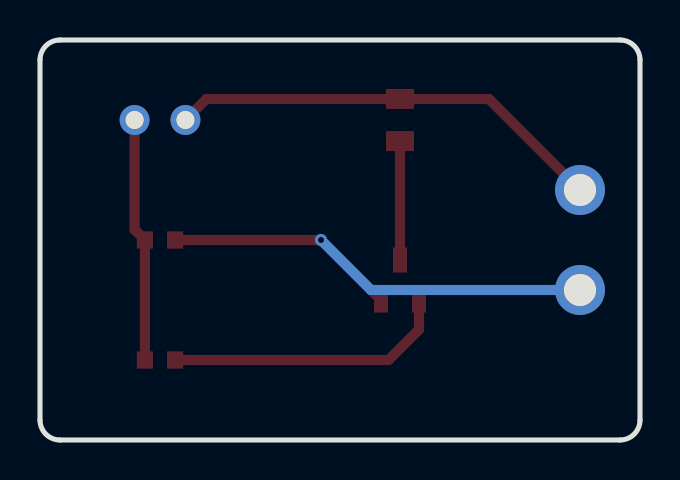
[diagram p9: board, bottom side, seen from below]

Outline 30 x 20 mm; copper layers: Top Layer, Bottom Layer. Coordinates in mm from the lower left corner of the outline.
Outline path: 0,19 0,1 arc(0.29,0.29) 1,0 29,0 arc(29.71,0.29) 30,1 30,19 arc(29.71,19.71) 29,20 1,20 arc(0.29,19.71) 0,19
Stack: Top Layer 0.035mm / Dielectric1 1.51mm FR4 er 4.5 / Bottom Layer 0.035mm

## Design rules (mm)
template: JLCPCB Capability(Two Layers Board)
spacing copperThickness1oz (default): track to track 0.102, other pairs 0.152 to 0.3
spacing copperThickness2oz: track to track 0.203, other pairs 0.152 to 0.3
track width copperThickness1oz (default): min 0.127, default 0.254, max 2.54
track width copperThickness2oz: min 0.203, default 0.254, max 2.54
differential pair differentialPair (default): width min 0.127, default 0.254, max 2.54; gap min 0.152, default 0.152
via viaSize (default): diameter min 0.5, default 0.61, max 10; hole min 0.3, default 0.305, max 6.3

## Placement (name value [footprint] x y rotation side)
LED1  NCD0805R1  [LED0805-R-RD]  12 16 90 top
R1  200Ω  [R0603]  24 4 0 top
U1  DY-PT333B-A0(HF)  [LED-TH_BD5.9-RD_DY-PT334-6B]  24 16 180 top
U2  5kΩ  [R0603]  24 10 0 top
U3  SS8050  [SOT-23-3_L2.9-W1.3-P1.90-LS2.4-BR]  12 8 270 top
U4  DB301V-5.0-2P-BU-P  [CONN-TH_2P-P5.00_DB301V-5.0-2P-BU-P]  3 10 90 top

## Footprints (pads in the part's own frame, mm; a bottom-side part is the same pattern mirrored in y, then rotated)
CONN-TH_2P-P5.00_DB301V-5.0-2P-BU-P
  round 2.5 hole 1.6: 1(-2.5,0) 2(2.5,0)
LED0805-R-RD
  rect 1x1.399 smd: 1(1.05,0) 2(-1.05,0)
LED-TH_BD5.9-RD_DY-PT334-6B
  round 1.5 hole 0.9: 1(-1.27,0) 2(1.27,0)
R0603
  rect 0.806x0.864 smd: 1(-0.753,0) 2(0.753,0)
SOT-23-3_L2.9-W1.3-P1.90-LS2.4-BR
  rect 1.25x0.7 smd: 1(1,-0.95) 2(1,0.95) 3(-1,0)

## Nets
As in the schematic.

## Via types
v1: diameter 0.61, hole 0.305, Top Layer to Bottom Layer, 1 via

## Routing (per net, layer and track width the routed paths; a pad name or vN(x,y) marks a point on that pad's centre or on a via; arc(x,y) is an arc through that point)
GND: length 25.5
  Top Layer w0.508: U3.2 v1(15.95,10) U2.1
  Bottom Layer w0.508: v1(15.95,10) 13.45,7.5 U4.1
VCC: length 22.1
  Top Layer w0.508: U1.2 21.68,17.05 LED1.1 7.55,17.05 U4.2
$1N413: length 14.3
  Top Layer w0.508: R1.1 12.57,4 11.05,5.52 U3.1
$1N527: length 5.9
  Top Layer w0.508: LED1.2 U3.3
$1N534: length 12.2
  Top Layer w0.508: R1.2 U2.2 25.27,10.52 U1.1
